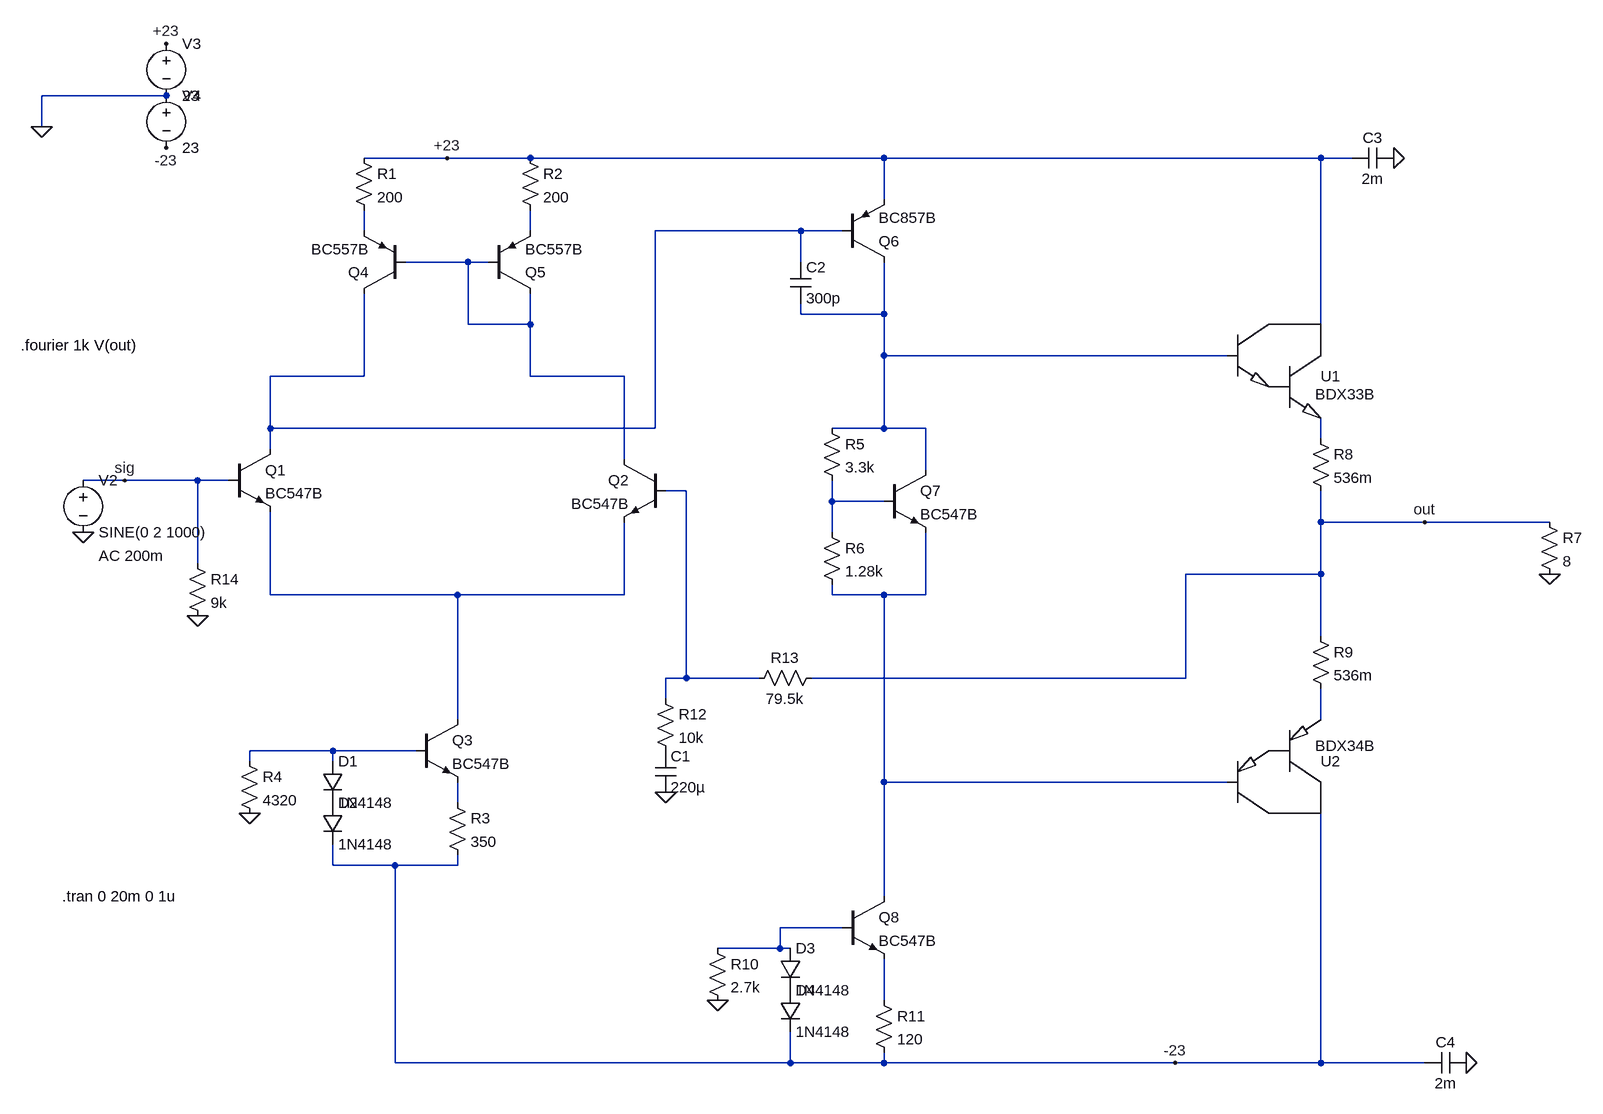
[diagram p0: schematic effektforstaerker.asc]
effektforstaerker.asc, the LTspice schematic file:
Version 4
SHEET 1 2408 1380
WIRE -96 -192 -288 -192
WIRE -288 -144 -288 -192
WIRE 336 -96 208 -96
WIRE 464 -96 336 -96
WIRE 1008 -96 464 -96
WIRE 1680 -96 1008 -96
WIRE 1728 -96 1680 -96
WIRE 1008 -32 1008 -96
WIRE 208 16 208 -16
WIRE 464 16 464 -16
WIRE 880 16 656 16
WIRE 944 16 880 16
WIRE 368 64 272 64
WIRE 400 64 368 64
WIRE 880 64 880 16
WIRE 880 144 880 128
WIRE 1008 144 1008 64
WIRE 1008 144 880 144
WIRE 368 160 368 64
WIRE 464 160 464 112
WIRE 464 160 368 160
WIRE 1680 160 1680 -96
WIRE 1008 208 1008 144
WIRE 1536 208 1008 208
WIRE 208 240 208 112
WIRE 208 240 64 240
WIRE 464 240 464 160
WIRE 608 240 464 240
WIRE 64 320 64 240
WIRE 656 320 656 16
WIRE 656 320 64 320
WIRE 1008 320 1008 208
WIRE 1008 320 928 320
WIRE 1072 320 1008 320
WIRE 1680 336 1680 304
WIRE 64 352 64 320
WIRE 608 368 608 240
WIRE 1072 384 1072 320
WIRE -160 400 -224 400
WIRE -48 400 -160 400
WIRE 0 400 -48 400
WIRE 704 416 672 416
WIRE 928 432 928 400
WIRE 1008 432 928 432
WIRE 1680 464 1680 416
WIRE 1840 464 1680 464
WIRE 2032 464 1840 464
WIRE 928 480 928 432
WIRE -48 528 -48 400
WIRE 1680 544 1680 464
WIRE 1680 544 1472 544
WIRE 64 576 64 448
WIRE 352 576 64 576
WIRE 608 576 608 464
WIRE 608 576 352 576
WIRE 928 576 928 560
WIRE 1008 576 928 576
WIRE 1072 576 1072 480
WIRE 1072 576 1008 576
WIRE 1680 640 1680 544
WIRE 704 704 704 416
WIRE 704 704 672 704
WIRE 816 704 704 704
WIRE 1472 704 1472 544
WIRE 1472 704 896 704
WIRE 672 736 672 704
WIRE 352 768 352 576
WIRE 1680 768 1680 720
WIRE 160 816 32 816
WIRE 288 816 160 816
WIRE 32 832 32 816
WIRE 160 832 160 816
WIRE 1008 864 1008 576
WIRE 1536 864 1008 864
WIRE 352 896 352 864
WIRE 160 992 160 960
WIRE 256 992 160 992
WIRE 352 992 352 976
WIRE 352 992 256 992
WIRE 1008 1040 1008 864
WIRE 944 1088 848 1088
WIRE 848 1120 848 1088
WIRE 848 1120 752 1120
WIRE 864 1120 848 1120
WIRE 1008 1200 1008 1136
WIRE 256 1296 256 992
WIRE 864 1296 864 1248
WIRE 864 1296 256 1296
WIRE 1008 1296 1008 1280
WIRE 1008 1296 864 1296
WIRE 1456 1296 1008 1296
WIRE 1680 1296 1680 912
WIRE 1680 1296 1456 1296
WIRE 1840 1296 1680 1296
FLAG 32 912 0
FLAG -224 480 0
FLAG -288 -144 0
FLAG 336 -96 +23
FLAG -96 -272 +23
FLAG -96 -112 -23
FLAG 2032 544 0
FLAG 1456 1296 -23
FLAG 752 1200 0
FLAG 672 880 0
FLAG -48 608 0
FLAG 1792 -96 0
FLAG 1904 1296 0
FLAG 1840 464 out
FLAG -160 400 sig
SYMBOL res 192 -112 R0
SYMATTR InstName R1
SYMATTR Value 200
SYMBOL res 448 -112 R0
SYMATTR InstName R2
SYMATTR Value 200
SYMBOL res 336 880 R0
SYMATTR InstName R3
SYMATTR Value 350
SYMBOL npn 0 352 R0
SYMATTR InstName Q1
SYMATTR Value BC547B
SYMBOL npn 672 368 M0
SYMATTR InstName Q2
SYMATTR Value BC547B
SYMBOL npn 288 768 R0
SYMATTR InstName Q3
SYMATTR Value BC547B
SYMBOL pnp 272 112 R180
SYMATTR InstName Q4
SYMATTR Value BC557B
SYMBOL pnp 400 112 M180
SYMATTR InstName Q5
SYMATTR Value BC557B
SYMBOL diode 144 832 R0
SYMATTR InstName D1
SYMATTR Value 1N4148
SYMBOL diode 144 896 R0
SYMATTR InstName D2
SYMATTR Value 1N4148
SYMBOL voltage -224 384 R0
WINDOW 123 24 132 Left 0
WINDOW 39 0 0 Left 0
SYMATTR Value2 AC 200m
SYMATTR InstName V2
SYMATTR Value SINE(0 2 1000)
SYMBOL res 16 816 R0
SYMATTR InstName R4
SYMATTR Value 4320
SYMBOL voltage -96 -288 R0
WINDOW 123 0 0 Left 0
WINDOW 39 0 0 Left 0
SYMATTR InstName V3
SYMATTR Value 23
SYMBOL voltage -96 -208 R0
WINDOW 123 0 0 Left 0
WINDOW 39 0 0 Left 0
SYMATTR InstName V4
SYMATTR Value 23
SYMBOL pnp 944 64 M180
SYMATTR InstName Q6
SYMATTR Value BC857B
SYMBOL npn 1008 384 R0
SYMATTR InstName Q7
SYMATTR Value BC547B
SYMBOL res 912 304 R0
SYMATTR InstName R5
SYMATTR Value 3.3k
SYMBOL res 912 464 R0
SYMATTR InstName R6
SYMATTR Value 1.28k
SYMBOL myLib\\BDX33B 1552 160 R0
SYMATTR InstName U1
SYMBOL myLib\\BDX34B 1536 912 M180
SYMATTR InstName U2
SYMBOL res 2016 448 R0
SYMATTR InstName R7
SYMATTR Value 8
SYMBOL res 1664 320 R0
SYMATTR InstName R8
SYMATTR Value 536m
SYMBOL res 1664 624 R0
SYMATTR InstName R9
SYMATTR Value 536m
SYMBOL res 736 1104 R0
SYMATTR InstName R10
SYMATTR Value 2.7k
SYMBOL res 992 1184 R0
SYMATTR InstName R11
SYMATTR Value 120
SYMBOL npn 944 1040 R0
SYMATTR InstName Q8
SYMATTR Value BC547B
SYMBOL diode 848 1120 R0
SYMATTR InstName D3
SYMATTR Value 1N4148
SYMBOL diode 848 1184 R0
SYMATTR InstName D4
SYMATTR Value 1N4148
SYMBOL res 656 720 R0
SYMATTR InstName R12
SYMATTR Value 10k
SYMBOL res 912 688 R90
WINDOW 0 0 56 VBottom 0
WINDOW 3 32 56 VTop 0
SYMATTR InstName R13
SYMATTR Value 79.5k
SYMBOL cap 656 816 R0
SYMATTR InstName C1
SYMATTR Value 220µ
SYMBOL res -64 512 R0
SYMATTR InstName R14
SYMATTR Value 9k
SYMBOL cap 1792 -112 R90
WINDOW 0 0 32 VBottom 0
WINDOW 3 32 32 VTop 0
SYMATTR InstName C3
SYMATTR Value 2m
SYMBOL cap 1904 1280 R90
WINDOW 0 0 32 VBottom 0
WINDOW 3 32 32 VTop 0
SYMATTR InstName C4
SYMATTR Value 2m
SYMBOL cap 864 64 R0
SYMATTR InstName C2
SYMATTR Value 300p
TEXT -256 1040 Left 0 !.tran 0 20m 0 1u
TEXT -320 192 Left 0 !.fourier 1k V(out)

The netlist it stands for:
* effektforstaerker.asc
R1 +23 N001 200
R2 +23 N002 200
R3 N013 -23 350
Q1 N003 sig N009 0 BC547B
Q2 N004 N007 N009 0 BC547B
Q3 N009 N012 N013 0 BC547B
Q4 N003 N004 N001 0 BC557B
Q5 N004 N004 N002 0 BC557B
D1 N012 P001 1N4148
D2 P001 -23 1N4148
V2 sig 0 SINE(0 2 1000) AC 200m
R4 N012 0 4320
V3 +23 0 23
V4 0 -23 23
Q6 N005 N003 +23 0 BC857B
Q7 N005 N008 N010 0 BC547B
R5 N005 N008 3.3k
R6 N008 N010 1.28k
XU1 +23 N005 N006 BDX33B  ; pins C B E
XU2 -23 N010 N011 BDX34B  ; pins C B E
R7 out 0 8
R8 N006 out 536m
R9 out N011 536m
R10 N014 0 2.7k
R11 N015 -23 120
Q8 N010 N014 N015 0 BC547B
D3 N014 P002 1N4148
D4 P002 -23 1N4148
R12 N007 P003 10k
R13 out N007 79.5k
C1 P003 0 220µ
R14 sig 0 9k
C3 0 +23 2m
C4 0 -23 2m
C2 N003 N005 300p
.model D D
.lib standard.dio
.model NPN NPN
.model PNP PNP
.lib standard.bjt
.tran 0 20m 0 1u
.fourier 1k V(out)
.lib myLib\BDX33B.lib
.lib myLib\BDX34B.lib
.backanno
.end